# Altium schematic sheet DRAM DDR4 bank 1 Connector.SchDoc
size 594 x 420 mm; Author: ALTIUM GOSTBOM2.0 KEV; SheetNumber: 6; SheetTotal: 48
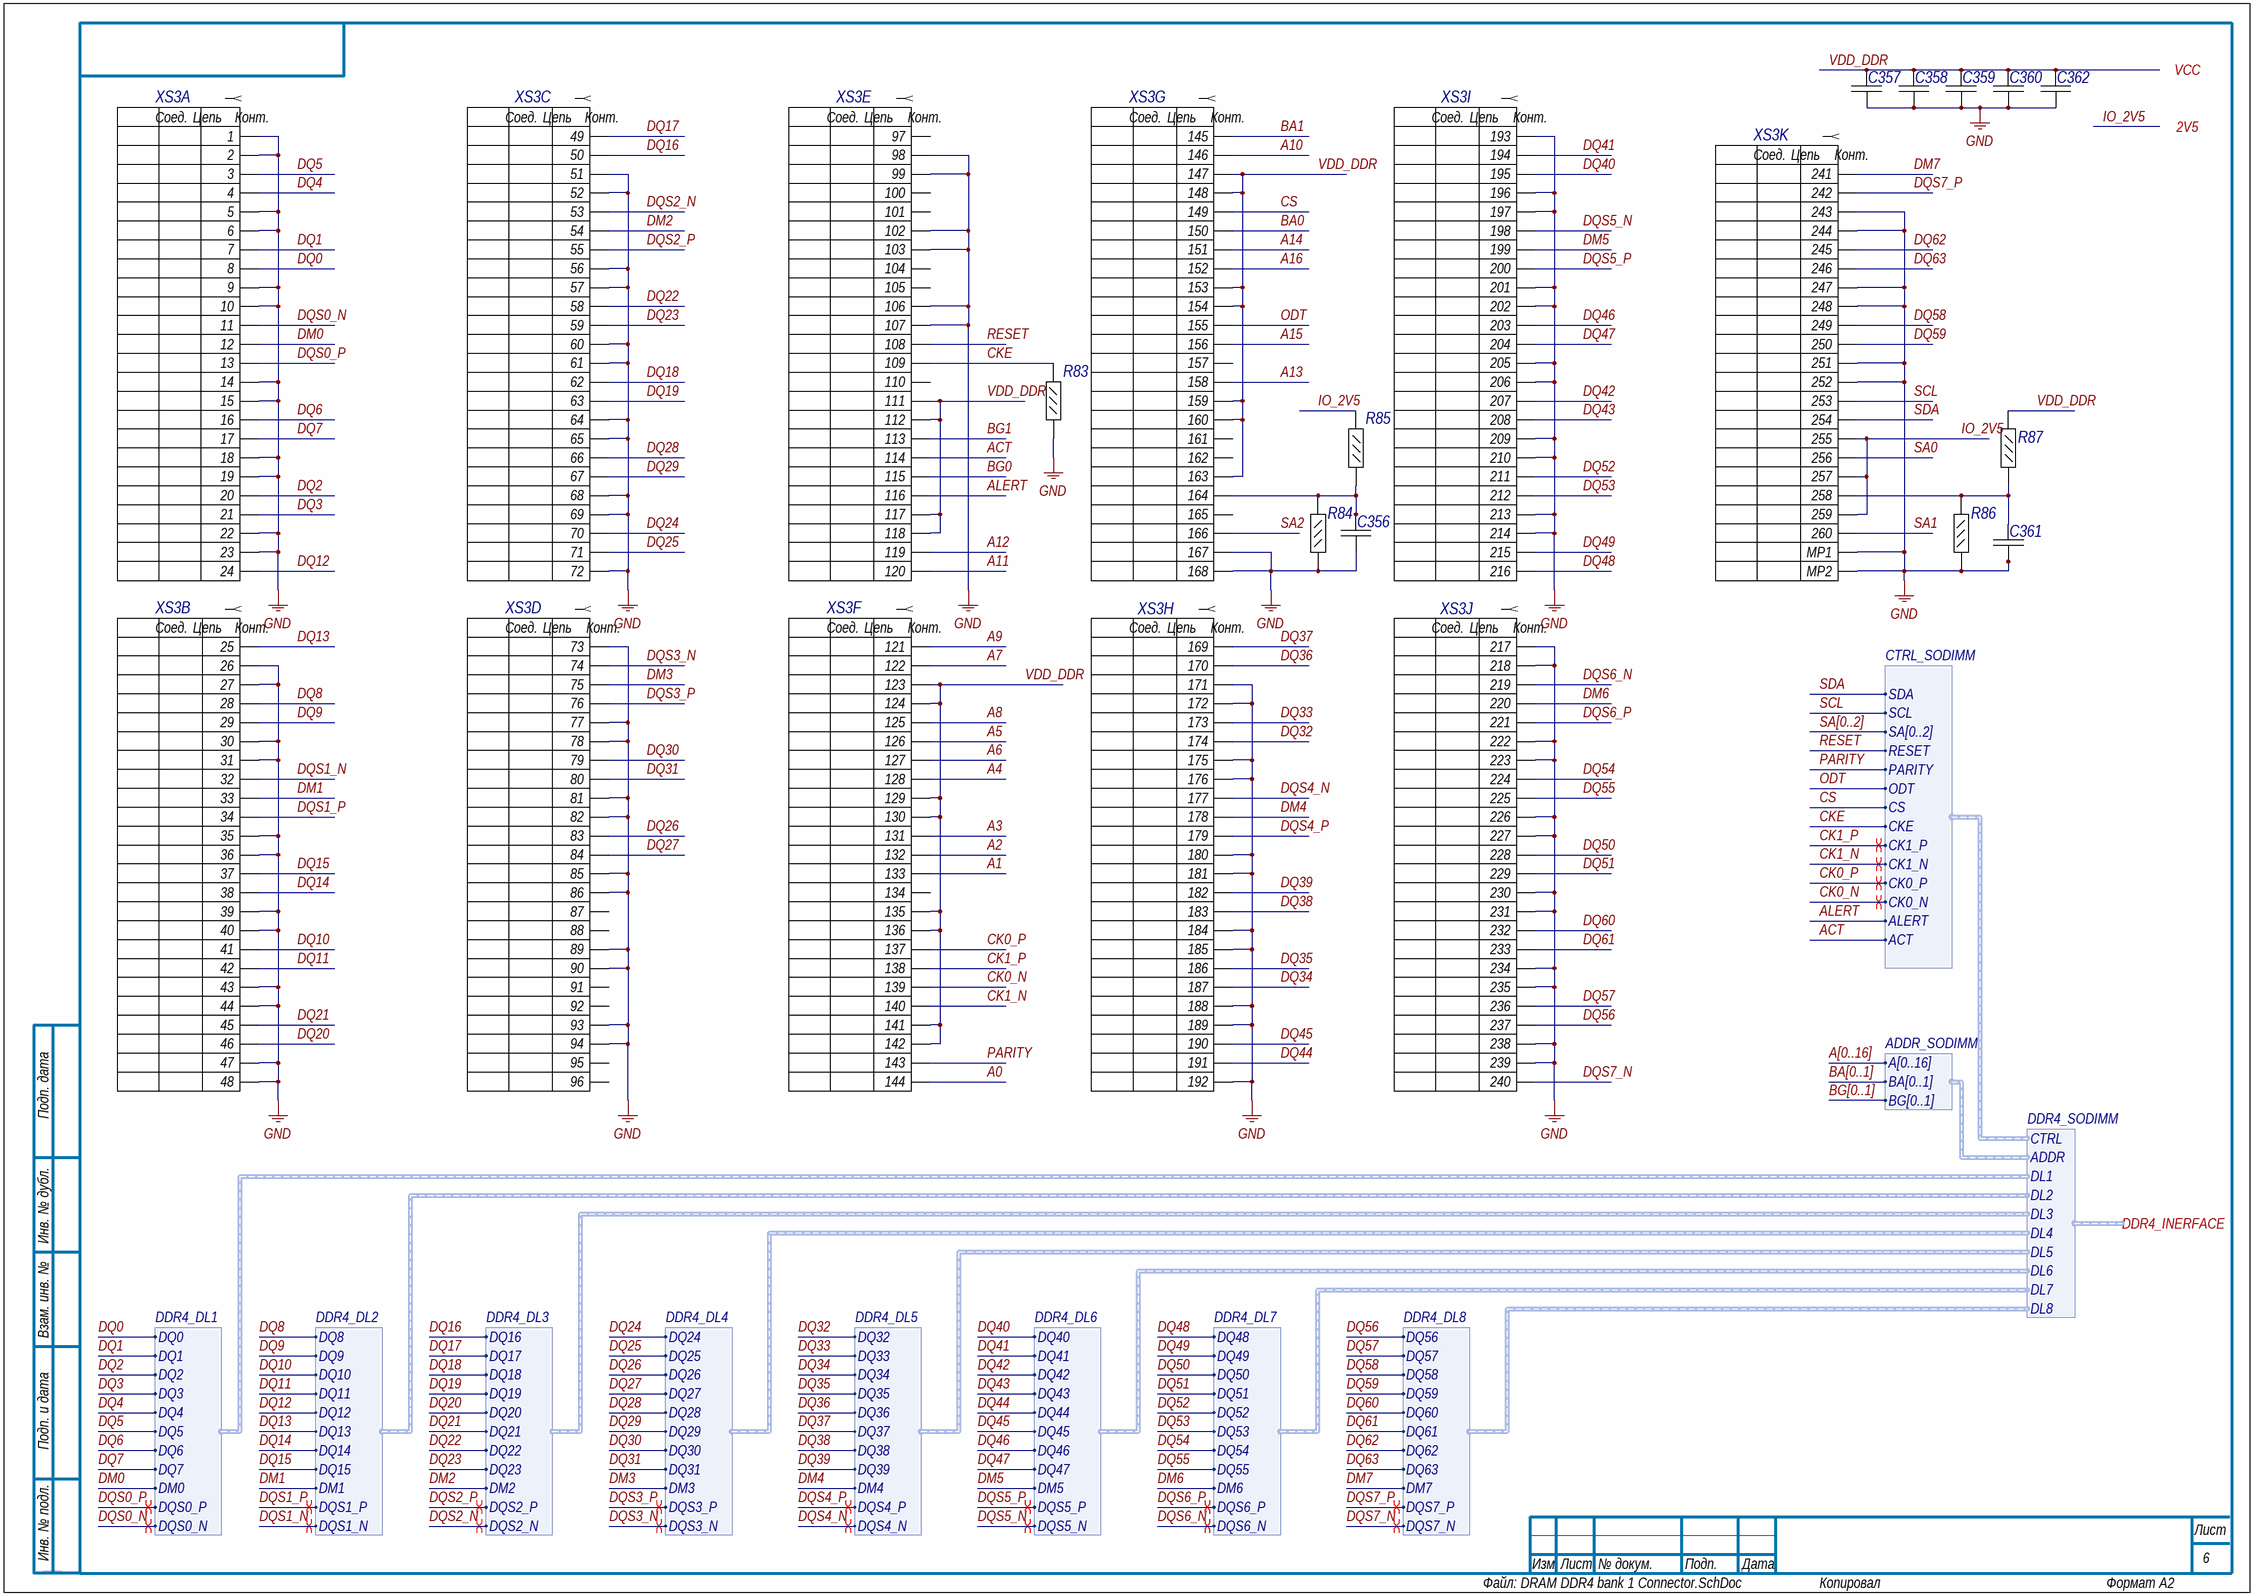
[diagram p0: DRAM DDR4 bank 1 Connector.SchDoc]

## Parts
C356  C1005X7R1E104M  [CAPC1005X55X10LL05]  (value not drawn)
C357  C1005X7R1E104M  [CAPC1005X55X10LL05]  (value not drawn)
C358  C1005X7R1E104M  [CAPC1005X55X10LL05]  (value not drawn)
C359  C1005X7R1E104M  [CAPC1005X55X10LL05]  (value not drawn)
C360  C1005X7R1E104M  [CAPC1005X55X10LL05]  (value not drawn)
C361  C1005X7R1E104M  [CAPC1005X55X10LL05]  (value not drawn)
C362  C1005X7R1E104M  [CAPC1005X55X10LL05]  (value not drawn)
R83  RC0402JR-0739RL  [RESC1005X40X25LL05T05]  (value not drawn)
R84  RC0402JR-0739RL  [RESC1005X40X25LL05T05]  (value not drawn)
R85  RC0402JR-0739RL  [RESC1005X40X25LL05T05]  (value not drawn)
R86  RC0402JR-0739RL  [RESC1005X40X25LL05T05]  (value not drawn)
R87  RC0402JR-0739RL  [RESC1005X40X25LL05T05]  (value not drawn)
XS3  AS0A823-H8SB-7H  [FOXC-AS0A823-H8SB-7H_V]  (value not drawn)  (parts A,B,C,D,E,F,G,H,I,J,K of 11)

## Ports
2V5, DDR4_INERFACE (harness DDR4_SODIMM), VCC

## Harnesses
DDR4_DL1: DQ0, DQ1, DQ2, DQ3, DQ4, DQ5, DQ6, DQ7, DM0, DQS0_P, DQS0_N
DDR4_DL2: DQ8, DQ9, DQ10, DQ11, DQ12, DQ13, DQ14, DQ15, DM1, DQS1_P, DQS1_N
DDR4_DL3: DQ16, DQ17, DQ18, DQ19, DQ20, DQ21, DQ22, DQ23, DM2, DQS2_P, DQS2_N
DDR4_DL4: DQ24, DQ25, DQ26, DQ27, DQ28, DQ29, DQ30, DQ31, DM3, DQS3_P, DQS3_N
DDR4_DL5: DQ32, DQ33, DQ34, DQ35, DQ36, DQ37, DQ38, DQ39, DM4, DQS4_P, DQS4_N
DDR4_DL6: DQ40, DQ41, DQ42, DQ43, DQ44, DQ45, DQ46, DQ47, DM5, DQS5_P, DQS5_N
DDR4_DL7: DQ48, DQ49, DQ50, DQ51, DQ52, DQ53, DQ54, DQ55, DM6, DQS6_P, DQS6_N
DDR4_DL8: DQ56, DQ57, DQ58, DQ59, DQ60, DQ61, DQ62, DQ63, DM7, DQS7_P, DQS7_N
DDR4_SODIMM: CTRL, ADDR, DL1, DL2, DL3, DL4, DL5, DL6, DL7, DL8
ADDR_SODIMM: A[0..16], BA[0..1], BG[0..1]
CTRL_SODIMM: SDA, SCL, SA[0..2], RESET, PARITY, ODT, CS, CKE, CK1_P, CK1_N, CK0_P, CK0_N, ALERT, ACT

## Nets
GND: C356.1 C357.2 C358.2 C359.2 C360.2 C361.2 C362.2 R83.1 R84.1 R86.1 XS3.1 XS3.2 XS3.5 XS3.6 XS3.9 XS3.10 XS3.14 XS3.15 XS3.18 XS3.19 XS3.22 XS3.23 XS3.26 XS3.27 XS3.30 XS3.31 XS3.35 XS3.36 XS3.39 XS3.40 XS3.43 XS3.44 XS3.47 XS3.48 XS3.51 XS3.52 XS3.56 XS3.57 XS3.60 XS3.61 XS3.64 XS3.65 XS3.68 XS3.69 XS3.72 XS3.73 XS3.77 XS3.78 XS3.81 XS3.82 XS3.85 XS3.86 XS3.89 XS3.90 XS3.93 XS3.94 XS3.98 XS3.99 XS3.102 XS3.103 XS3.106 XS3.107 XS3.167 XS3.168 XS3.171 XS3.172 XS3.175 XS3.176 XS3.180 XS3.181 XS3.184 XS3.185 XS3.188 XS3.189 XS3.192 XS3.193 XS3.196 XS3.197 XS3.201 XS3.202 XS3.205 XS3.206 XS3.209 XS3.210 XS3.213 XS3.214 XS3.217 XS3.218 XS3.222 XS3.223 XS3.226 XS3.227 XS3.230 XS3.231 XS3.234 XS3.235 XS3.238 XS3.239 XS3.243 XS3.244 XS3.247 XS3.248 XS3.251 XS3.252 XS3.MP1 XS3.MP2
A0: XS3.144
A1: XS3.133
A2: XS3.132
A3: XS3.131
A4: XS3.128
A5: XS3.126
A6: XS3.127
A7: XS3.122
A8: XS3.125
A9: XS3.121
A10: XS3.146
A11: XS3.120
A12: XS3.119
A13: XS3.158
A14: XS3.151
A15: XS3.156
A16: XS3.152
ACT: XS3.114 ; harness CTRL_SODIMM.ACT
ALERT: XS3.116 ; harness CTRL_SODIMM.ALERT
BA0: XS3.150
BA1: XS3.145
BG0: XS3.115
BG1: XS3.113
CK0_N: XS3.139 ; harness CTRL_SODIMM.CK0_N
CK0_P: XS3.137 ; harness CTRL_SODIMM.CK0_P
CK1_N: XS3.140 ; harness CTRL_SODIMM.CK1_N
CK1_P: XS3.138 ; harness CTRL_SODIMM.CK1_P
CKE: R83.2 XS3.109 ; harness CTRL_SODIMM.CKE
CS: XS3.149 ; harness CTRL_SODIMM.CS
DM0: XS3.12 ; harness DDR4_DL1.DM0
DM1: XS3.33 ; harness DDR4_DL2.DM1
DM2: XS3.54 ; harness DDR4_DL3.DM2
DM3: XS3.75 ; harness DDR4_DL4.DM3
DM4: XS3.178 ; harness DDR4_DL5.DM4
DM5: XS3.199 ; harness DDR4_DL6.DM5
DM6: XS3.220 ; harness DDR4_DL7.DM6
DM7: XS3.241 ; harness DDR4_DL8.DM7
DQ0: XS3.8 ; harness DDR4_DL1.DQ0
DQ1: XS3.7 ; harness DDR4_DL1.DQ1
DQ2: XS3.20 ; harness DDR4_DL1.DQ2
DQ3: XS3.21 ; harness DDR4_DL1.DQ3
DQ4: XS3.4 ; harness DDR4_DL1.DQ4
DQ5: XS3.3 ; harness DDR4_DL1.DQ5
DQ6: XS3.16 ; harness DDR4_DL1.DQ6
DQ7: XS3.17 ; harness DDR4_DL1.DQ7
DQ8: XS3.28 ; harness DDR4_DL2.DQ8
DQ9: XS3.29 ; harness DDR4_DL2.DQ9
DQ10: XS3.41 ; harness DDR4_DL2.DQ10
DQ11: XS3.42 ; harness DDR4_DL2.DQ11
DQ12: XS3.24 ; harness DDR4_DL2.DQ12
DQ13: XS3.25 ; harness DDR4_DL2.DQ13
DQ14: XS3.38 ; harness DDR4_DL2.DQ14
DQ15: XS3.37 ; harness DDR4_DL2.DQ15
DQ16: XS3.50 ; harness DDR4_DL3.DQ16
DQ17: XS3.49 ; harness DDR4_DL3.DQ17
DQ18: XS3.62 ; harness DDR4_DL3.DQ18
DQ19: XS3.63 ; harness DDR4_DL3.DQ19
DQ20: XS3.46 ; harness DDR4_DL3.DQ20
DQ21: XS3.45 ; harness DDR4_DL3.DQ21
DQ22: XS3.58 ; harness DDR4_DL3.DQ22
DQ23: XS3.59 ; harness DDR4_DL3.DQ23
DQ24: XS3.70 ; harness DDR4_DL4.DQ24
DQ25: XS3.71 ; harness DDR4_DL4.DQ25
DQ26: XS3.83 ; harness DDR4_DL4.DQ26
DQ27: XS3.84 ; harness DDR4_DL4.DQ27
DQ28: XS3.66 ; harness DDR4_DL4.DQ28
DQ29: XS3.67 ; harness DDR4_DL4.DQ29
DQ30: XS3.79 ; harness DDR4_DL4.DQ30
DQ31: XS3.80 ; harness DDR4_DL4.DQ31
DQ32: XS3.174 ; harness DDR4_DL5.DQ32
DQ33: XS3.173 ; harness DDR4_DL5.DQ33
DQ34: XS3.187 ; harness DDR4_DL5.DQ34
DQ35: XS3.186 ; harness DDR4_DL5.DQ35
DQ36: XS3.170 ; harness DDR4_DL5.DQ36
DQ37: XS3.169 ; harness DDR4_DL5.DQ37
DQ38: XS3.183 ; harness DDR4_DL5.DQ38
DQ39: XS3.182 ; harness DDR4_DL5.DQ39
DQ40: XS3.195 ; harness DDR4_DL6.DQ40
DQ41: XS3.194 ; harness DDR4_DL6.DQ41
DQ42: XS3.207 ; harness DDR4_DL6.DQ42
DQ43: XS3.208 ; harness DDR4_DL6.DQ43
DQ44: XS3.191 ; harness DDR4_DL6.DQ44
DQ45: XS3.190 ; harness DDR4_DL6.DQ45
DQ46: XS3.203 ; harness DDR4_DL6.DQ46
DQ47: XS3.204 ; harness DDR4_DL6.DQ47
DQ48: XS3.216 ; harness DDR4_DL7.DQ48
DQ49: XS3.215 ; harness DDR4_DL7.DQ49
DQ50: XS3.228 ; harness DDR4_DL7.DQ50
DQ51: XS3.229 ; harness DDR4_DL7.DQ51
DQ52: XS3.211 ; harness DDR4_DL7.DQ52
DQ53: XS3.212 ; harness DDR4_DL7.DQ53
DQ54: XS3.224 ; harness DDR4_DL7.DQ54
DQ55: XS3.225 ; harness DDR4_DL7.DQ55
DQ56: XS3.237 ; harness DDR4_DL8.DQ56
DQ57: XS3.236 ; harness DDR4_DL8.DQ57
DQ58: XS3.249 ; harness DDR4_DL8.DQ58
DQ59: XS3.250 ; harness DDR4_DL8.DQ59
DQ60: XS3.232 ; harness DDR4_DL8.DQ60
DQ61: XS3.233 ; harness DDR4_DL8.DQ61
DQ62: XS3.245 ; harness DDR4_DL8.DQ62
DQ63: XS3.246 ; harness DDR4_DL8.DQ63
DQS0_N: XS3.11 ; harness DDR4_DL1.DQS0_N
DQS0_P: XS3.13 ; harness DDR4_DL1.DQS0_P
DQS1_N: XS3.32 ; harness DDR4_DL2.DQS1_N
DQS1_P: XS3.34 ; harness DDR4_DL2.DQS1_P
DQS2_N: XS3.53 ; harness DDR4_DL3.DQS2_N
DQS2_P: XS3.55 ; harness DDR4_DL3.DQS2_P
DQS3_N: XS3.74 ; harness DDR4_DL4.DQS3_N
DQS3_P: XS3.76 ; harness DDR4_DL4.DQS3_P
DQS4_N: XS3.177 ; harness DDR4_DL5.DQS4_N
DQS4_P: XS3.179 ; harness DDR4_DL5.DQS4_P
DQS5_N: XS3.198 ; harness DDR4_DL6.DQS5_N
DQS5_P: XS3.200 ; harness DDR4_DL6.DQS5_P
DQS6_N: XS3.219 ; harness DDR4_DL7.DQS6_N
DQS6_P: XS3.221 ; harness DDR4_DL7.DQS6_P
DQS7_N: XS3.240 ; harness DDR4_DL8.DQS7_N
DQS7_P: XS3.242 ; harness DDR4_DL8.DQS7_P
IO_2V5: R85.1 XS3.255 XS3.257 XS3.259 ; port 2V5
ODT: XS3.155 ; harness CTRL_SODIMM.ODT
PARITY: XS3.143 ; harness CTRL_SODIMM.PARITY
RESET: XS3.108 ; harness CTRL_SODIMM.RESET
SA0: XS3.256
SA1: XS3.260
SA2: XS3.166
SCL: XS3.253 ; harness CTRL_SODIMM.SCL
SDA: XS3.254 ; harness CTRL_SODIMM.SDA
VDD_DDR: C357.1 C358.1 C359.1 C360.1 C362.1 R87.1 XS3.111 XS3.112 XS3.117 XS3.118 XS3.123 XS3.124 XS3.129 XS3.130 XS3.135 XS3.136 XS3.141 XS3.142 XS3.147 XS3.148 XS3.153 XS3.154 XS3.159 XS3.160 XS3.163 ; port VCC
NetC356_2: C356.2 R84.2 R85.2 XS3.164
NetC361_1: C361.1 R86.2 R87.2 XS3.258

Not connected (* = marked no-connect by the designer): XS3 87 88 91 92 95 96 97 100 101 104 105 110 134 157 161 162 165

## Buses and harness runs
bus A[0..16]
bus BA[0..1]
bus BG[0..1]
bus SA[0..2]

## Layout directives
differential pair: CK0_N, CK0_P, CK1_N, CK1_P, DQS0_N, DQS0_P, DQS1_N, DQS1_P, DQS2_N, DQS2_P, DQS3_N, DQS3_P, DQS4_N, DQS4_P, DQS5_N, DQS5_P, DQS6_N, DQS6_P, DQS7_N, DQS7_P

## Notes on the sheet
- Подп. дата
- Инв. № дубл.
- Взам. инв. №
- Подп. и дата
- Инв. № подл.
- Изм.
- Лист
- № докум.
- Подп.
- Дата
- ALTIUM GOSTBOM2.0 KEV
- Файл:
- Копировал
- Формат А2
- (in symbol E36, part A) Соед.; Цепь; Конт.
- (in symbol E36, part B) Соед.; Цепь; Конт.
- (in symbol E36, part C) Соед.; Цепь; Конт.
- (in symbol E36, part D) Соед.; Цепь; Конт.
- (in symbol E36, part E) Соед.; Цепь; Конт.
- (in symbol E36, part F) Соед.; Цепь; Конт.
- (in symbol E36, part G) Соед.; Цепь; Конт.
- (in symbol E36, part H) Соед.; Цепь; Конт.
- (in symbol E36, part I) Соед.; Цепь; Конт.
- (in symbol E36, part J) Соед.; Цепь; Конт.
- (in symbol E36, part K) Соед.; Цепь; Конт.

## Library data of the parts
C356 = E11: Chip Capacitor, 0.1 uF, +/- 20%, 25 V, -55 to 125 degC, 0402 (1005 Metric), RoHS, Tape and Reel; Тип элемента: Конденсатор; Capacitance: 100 nF; Case\/Package: 0402; Type (Capacitors): X7R; Voltage Rating: 25 V; Old_des: C288; New_des: C356; UID: E11; Component Kind: Standard; Case Code (Imperial): 0402; Case Code (Metric): 1005; ComponentLink1Description: Manufacturer URL; ComponentLink1URL: http://www.tdk.com/; ComponentLink2Description: Datasheet; ComponentLink2URL: http://www.farnell.com/datasheets/1571323.pdf; DatasheetVersion: 09/2011; Length: 1 mm; Max Operating Temperature: 125 degC; Min Operating Temperature: -55 degC; Mounting Technology: Surface Mount; Package Quantity: 10000; PackageDescription: 2-Pin Surface Mount Device, Body 1 x 0.5 mm; Packaging: Tape and Reel; PartNumber: C1005X7R1E104M; RoHSCompliant: true; Tolerance: 20%; Width: 0.5 mm; Height: 0.5 mm; Mount: Surface Mount; PackageReference: 0402; Pins: 2; Voltage Rating (DC): 25 V
C357 = E11: Chip Capacitor, 0.1 uF, +/- 20%, 25 V, -55 to 125 degC, 0402 (1005 Metric), RoHS, Tape and Reel; Тип элемента: Конденсатор; Capacitance: 100 nF; Case\/Package: 0402; Type (Capacitors): X7R; Voltage Rating: 25 V; Old_des: C283; New_des: C357; UID: E11; Component Kind: Standard; Case Code (Imperial): 0402; Case Code (Metric): 1005; ComponentLink1Description: Manufacturer URL; ComponentLink1URL: http://www.tdk.com/; ComponentLink2Description: Datasheet; ComponentLink2URL: http://www.farnell.com/datasheets/1571323.pdf; DatasheetVersion: 09/2011; Length: 1 mm; Max Operating Temperature: 125 degC; Min Operating Temperature: -55 degC; Mounting Technology: Surface Mount; Package Quantity: 10000; PackageDescription: 2-Pin Surface Mount Device, Body 1 x 0.5 mm; Packaging: Tape and Reel; PartNumber: C1005X7R1E104M; RoHSCompliant: true; Tolerance: 20%; Width: 0.5 mm; Height: 0.5 mm; Mount: Surface Mount; PackageReference: 0402; Pins: 2; Voltage Rating (DC): 25 V
C358 = E11: Chip Capacitor, 0.1 uF, +/- 20%, 25 V, -55 to 125 degC, 0402 (1005 Metric), RoHS, Tape and Reel; Тип элемента: Конденсатор; Capacitance: 100 nF; Case\/Package: 0402; Type (Capacitors): X7R; Voltage Rating: 25 V; Old_des: C284; New_des: C358; UID: E11; Component Kind: Standard; Case Code (Imperial): 0402; Case Code (Metric): 1005; ComponentLink1Description: Manufacturer URL; ComponentLink1URL: http://www.tdk.com/; ComponentLink2Description: Datasheet; ComponentLink2URL: http://www.farnell.com/datasheets/1571323.pdf; DatasheetVersion: 09/2011; Length: 1 mm; Max Operating Temperature: 125 degC; Min Operating Temperature: -55 degC; Mounting Technology: Surface Mount; Package Quantity: 10000; PackageDescription: 2-Pin Surface Mount Device, Body 1 x 0.5 mm; Packaging: Tape and Reel; PartNumber: C1005X7R1E104M; RoHSCompliant: true; Tolerance: 20%; Width: 0.5 mm; Height: 0.5 mm; Mount: Surface Mount; PackageReference: 0402; Pins: 2; Voltage Rating (DC): 25 V
C359 = E11: Chip Capacitor, 0.1 uF, +/- 20%, 25 V, -55 to 125 degC, 0402 (1005 Metric), RoHS, Tape and Reel; Тип элемента: Конденсатор; Capacitance: 100 nF; Case\/Package: 0402; Type (Capacitors): X7R; Voltage Rating: 25 V; Old_des: C285; New_des: C359; UID: E11; Component Kind: Standard; Case Code (Imperial): 0402; Case Code (Metric): 1005; ComponentLink1Description: Manufacturer URL; ComponentLink1URL: http://www.tdk.com/; ComponentLink2Description: Datasheet; ComponentLink2URL: http://www.farnell.com/datasheets/1571323.pdf; DatasheetVersion: 09/2011; Length: 1 mm; Max Operating Temperature: 125 degC; Min Operating Temperature: -55 degC; Mounting Technology: Surface Mount; Package Quantity: 10000; PackageDescription: 2-Pin Surface Mount Device, Body 1 x 0.5 mm; Packaging: Tape and Reel; PartNumber: C1005X7R1E104M; RoHSCompliant: true; Tolerance: 20%; Width: 0.5 mm; Height: 0.5 mm; Mount: Surface Mount; PackageReference: 0402; Pins: 2; Voltage Rating (DC): 25 V
C360 = E11: Chip Capacitor, 0.1 uF, +/- 20%, 25 V, -55 to 125 degC, 0402 (1005 Metric), RoHS, Tape and Reel; Тип элемента: Конденсатор; Capacitance: 100 nF; Case\/Package: 0402; Type (Capacitors): X7R; Voltage Rating: 25 V; Old_des: C286; New_des: C360; UID: E11; Component Kind: Standard; Case Code (Imperial): 0402; Case Code (Metric): 1005; ComponentLink1Description: Manufacturer URL; ComponentLink1URL: http://www.tdk.com/; ComponentLink2Description: Datasheet; ComponentLink2URL: http://www.farnell.com/datasheets/1571323.pdf; DatasheetVersion: 09/2011; Length: 1 mm; Max Operating Temperature: 125 degC; Min Operating Temperature: -55 degC; Mounting Technology: Surface Mount; Package Quantity: 10000; PackageDescription: 2-Pin Surface Mount Device, Body 1 x 0.5 mm; Packaging: Tape and Reel; PartNumber: C1005X7R1E104M; RoHSCompliant: true; Tolerance: 20%; Width: 0.5 mm; Height: 0.5 mm; Mount: Surface Mount; PackageReference: 0402; Pins: 2; Voltage Rating (DC): 25 V
C361 = E11: Chip Capacitor, 0.1 uF, +/- 20%, 25 V, -55 to 125 degC, 0402 (1005 Metric), RoHS, Tape and Reel; Тип элемента: Конденсатор; Capacitance: 100 nF; Case\/Package: 0402; Type (Capacitors): X7R; Voltage Rating: 25 V; Old_des: C289; New_des: C361; UID: E11; Component Kind: Standard; Case Code (Imperial): 0402; Case Code (Metric): 1005; ComponentLink1Description: Manufacturer URL; ComponentLink1URL: http://www.tdk.com/; ComponentLink2Description: Datasheet; ComponentLink2URL: http://www.farnell.com/datasheets/1571323.pdf; DatasheetVersion: 09/2011; Length: 1 mm; Max Operating Temperature: 125 degC; Min Operating Temperature: -55 degC; Mounting Technology: Surface Mount; Package Quantity: 10000; PackageDescription: 2-Pin Surface Mount Device, Body 1 x 0.5 mm; Packaging: Tape and Reel; PartNumber: C1005X7R1E104M; RoHSCompliant: true; Tolerance: 20%; Width: 0.5 mm; Height: 0.5 mm; Mount: Surface Mount; PackageReference: 0402; Pins: 2; Voltage Rating (DC): 25 V
C362 = E11: Chip Capacitor, 0.1 uF, +/- 20%, 25 V, -55 to 125 degC, 0402 (1005 Metric), RoHS, Tape and Reel; Тип элемента: Конденсатор; Capacitance: 100 nF; Case\/Package: 0402; Type (Capacitors): X7R; Voltage Rating: 25 V; Old_des: C287; New_des: C362; UID: E11; Component Kind: Standard; Case Code (Imperial): 0402; Case Code (Metric): 1005; ComponentLink1Description: Manufacturer URL; ComponentLink1URL: http://www.tdk.com/; ComponentLink2Description: Datasheet; ComponentLink2URL: http://www.farnell.com/datasheets/1571323.pdf; DatasheetVersion: 09/2011; Length: 1 mm; Max Operating Temperature: 125 degC; Min Operating Temperature: -55 degC; Mounting Technology: Surface Mount; Package Quantity: 10000; PackageDescription: 2-Pin Surface Mount Device, Body 1 x 0.5 mm; Packaging: Tape and Reel; PartNumber: C1005X7R1E104M; RoHSCompliant: true; Tolerance: 20%; Width: 0.5 mm; Height: 0.5 mm; Mount: Surface Mount; PackageReference: 0402; Pins: 2; Voltage Rating (DC): 25 V
R83 = E97: Chip Resistor, 39 Ohm, +/- 5%, 0.063 W, -55 to 155 degC, 0402 (1005 Metric), RoHS, Tape and Reel; Тип элемента: Резистор; Voltage Rating: 50 V; Power Rating: 63 mW; Resistance: 39 Ohm; Old_des: R231; New_des: R83; UID: E97; Component Kind: Standard; Case Code (Imperial): 0402; Case Code (Metric): 1005; Case/Package: 0402; ComponentLink1Description: Manufacturer URL; ComponentLink1URL: http://www.yageo.com/; ComponentLink2Description: Datasheet; ComponentLink2URL: http://www.yageo.com/documents/recent/PYu-RC_Group_51_RoHS_L_04.pdf; DatasheetVersion: Rev. 4, 02/2016; Length: 1 mm; Max Operating Temperature: 155 degC; Min Operating Temperature: -55 degC; Mounting Technology: Surface Mount; Package Quantity: 1; PackageDescription: 2-Pin Surface Mount Device, Body 1 x 0.5 mm; Packaging: Cut Tape; PartNumber: RC0402JR-0739RL; RoHSCompliant: true; Tolerance: 5%; Width: 0.5 mm; Height: 0.35 mm; Mount: Surface Mount; Pins: 2; REACH SVHC: No SVHC; Voltage Rating (DC): 50 V
R84 = E97: Chip Resistor, 39 Ohm, +/- 5%, 0.063 W, -55 to 155 degC, 0402 (1005 Metric), RoHS, Tape and Reel; Тип элемента: Резистор; Voltage Rating: 50 V; Power Rating: 63 mW; Resistance: 39 Ohm; Old_des: R228; New_des: R84; UID: E97; Component Kind: Standard; Case Code (Imperial): 0402; Case Code (Metric): 1005; Case/Package: 0402; ComponentLink1Description: Manufacturer URL; ComponentLink1URL: http://www.yageo.com/; ComponentLink2Description: Datasheet; ComponentLink2URL: http://www.yageo.com/documents/recent/PYu-RC_Group_51_RoHS_L_04.pdf; DatasheetVersion: Rev. 4, 02/2016; Length: 1 mm; Max Operating Temperature: 155 degC; Min Operating Temperature: -55 degC; Mounting Technology: Surface Mount; Package Quantity: 1; PackageDescription: 2-Pin Surface Mount Device, Body 1 x 0.5 mm; Packaging: Cut Tape; PartNumber: RC0402JR-0739RL; RoHSCompliant: true; Tolerance: 5%; Width: 0.5 mm; Height: 0.35 mm; Mount: Surface Mount; Pins: 2; REACH SVHC: No SVHC; Voltage Rating (DC): 50 V
R85 = E97: Chip Resistor, 39 Ohm, +/- 5%, 0.063 W, -55 to 155 degC, 0402 (1005 Metric), RoHS, Tape and Reel; Тип элемента: Резистор; Voltage Rating: 50 V; Power Rating: 63 mW; Resistance: 39 Ohm; Old_des: R227; New_des: R85; UID: E97; Component Kind: Standard; Case Code (Imperial): 0402; Case Code (Metric): 1005; Case/Package: 0402; ComponentLink1Description: Manufacturer URL; ComponentLink1URL: http://www.yageo.com/; ComponentLink2Description: Datasheet; ComponentLink2URL: http://www.yageo.com/documents/recent/PYu-RC_Group_51_RoHS_L_04.pdf; DatasheetVersion: Rev. 4, 02/2016; Length: 1 mm; Max Operating Temperature: 155 degC; Min Operating Temperature: -55 degC; Mounting Technology: Surface Mount; Package Quantity: 1; PackageDescription: 2-Pin Surface Mount Device, Body 1 x 0.5 mm; Packaging: Cut Tape; PartNumber: RC0402JR-0739RL; RoHSCompliant: true; Tolerance: 5%; Width: 0.5 mm; Height: 0.35 mm; Mount: Surface Mount; Pins: 2; REACH SVHC: No SVHC; Voltage Rating (DC): 50 V
R86 = E97: Chip Resistor, 39 Ohm, +/- 5%, 0.063 W, -55 to 155 degC, 0402 (1005 Metric), RoHS, Tape and Reel; Тип элемента: Резистор; Voltage Rating: 50 V; Power Rating: 63 mW; Resistance: 39 Ohm; Old_des: R230; New_des: R86; UID: E97; Component Kind: Standard; Case Code (Imperial): 0402; Case Code (Metric): 1005; Case/Package: 0402; ComponentLink1Description: Manufacturer URL; ComponentLink1URL: http://www.yageo.com/; ComponentLink2Description: Datasheet; ComponentLink2URL: http://www.yageo.com/documents/recent/PYu-RC_Group_51_RoHS_L_04.pdf; DatasheetVersion: Rev. 4, 02/2016; Length: 1 mm; Max Operating Temperature: 155 degC; Min Operating Temperature: -55 degC; Mounting Technology: Surface Mount; Package Quantity: 1; PackageDescription: 2-Pin Surface Mount Device, Body 1 x 0.5 mm; Packaging: Cut Tape; PartNumber: RC0402JR-0739RL; RoHSCompliant: true; Tolerance: 5%; Width: 0.5 mm; Height: 0.35 mm; Mount: Surface Mount; Pins: 2; REACH SVHC: No SVHC; Voltage Rating (DC): 50 V
R87 = E97: Chip Resistor, 39 Ohm, +/- 5%, 0.063 W, -55 to 155 degC, 0402 (1005 Metric), RoHS, Tape and Reel; Тип элемента: Резистор; Voltage Rating: 50 V; Power Rating: 63 mW; Resistance: 39 Ohm; Old_des: R229; New_des: R87; UID: E97; Component Kind: Standard; Case Code (Imperial): 0402; Case Code (Metric): 1005; Case/Package: 0402; ComponentLink1Description: Manufacturer URL; ComponentLink1URL: http://www.yageo.com/; ComponentLink2Description: Datasheet; ComponentLink2URL: http://www.yageo.com/documents/recent/PYu-RC_Group_51_RoHS_L_04.pdf; DatasheetVersion: Rev. 4, 02/2016; Length: 1 mm; Max Operating Temperature: 155 degC; Min Operating Temperature: -55 degC; Mounting Technology: Surface Mount; Package Quantity: 1; PackageDescription: 2-Pin Surface Mount Device, Body 1 x 0.5 mm; Packaging: Cut Tape; PartNumber: RC0402JR-0739RL; RoHSCompliant: true; Tolerance: 5%; Width: 0.5 mm; Height: 0.35 mm; Mount: Surface Mount; Pins: 2; REACH SVHC: No SVHC; Voltage Rating (DC): 50 V
XS3 = E36: Surface Mount Horizontal Type DDR4 DIMM Socket Connector, 260 Position, Pitch 0.5 mm, -55 to 85 degC, Halogen/Lead Free, Tape and Reel; Тип элемента: Соединитель; Old_des: J8; New_des: XS3; UID: E36; Component Kind: Standard; ComponentLink1Description: Manufacturer URL; ComponentLink1URL: http://www.foxconn.com/; ComponentLink2Description: Datasheet; ComponentLink2URL: https://drive.google.com/drive/folders/0By4GUdJb-DJ9Um5lRWw4YjB4d2c; DatasheetVersion: Rev. A, 10/2013; Mounting Technology: Surface Mount; PackageDescription: 260-Pin Surface Mount Device, Body Length 73.1 mm, Pitch 0.5 mm; PartNumber: AS0A823-H8SB-7H; System: Connector